# EAGLE design teatimer (EAGLE 8.0.0)
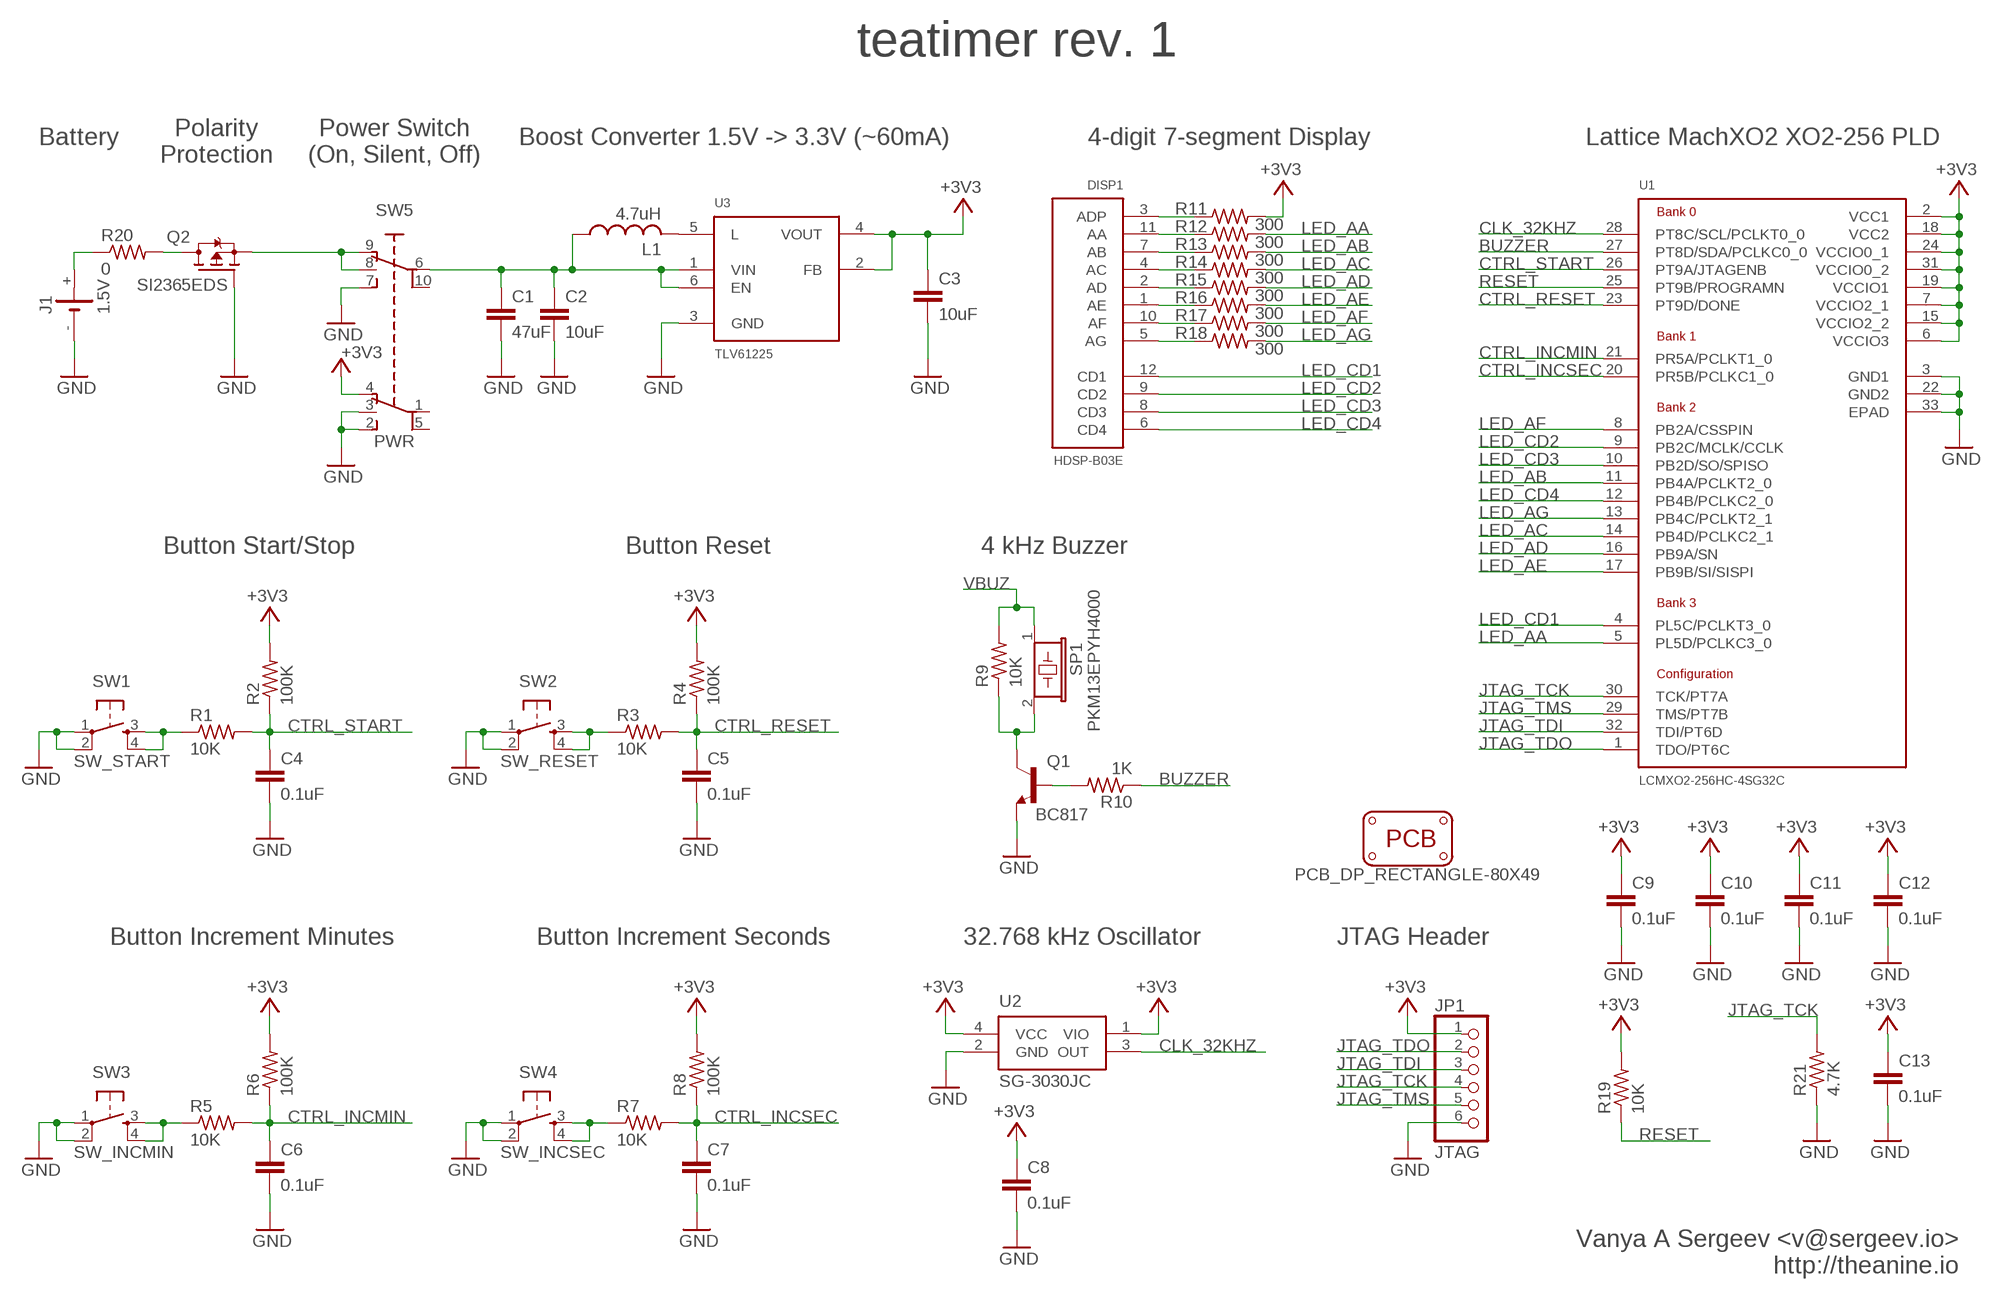
[diagram p0: schematic, sheet 1]

## Parts
C1  47uF  C-EUC0805  [C0805]
C2  10uF  C-EUC0603  [C0603]
C3  10uF  C-EUC0603  [C0603]
C4  0.1uF  C-EUC0603  [C0603]
C5  0.1uF  C-EUC0603  [C0603]
C6  0.1uF  C-EUC0603  [C0603]
C7  0.1uF  C-EUC0603  [C0603]
C8  0.1uF  C-EUC0603  [C0603]
C9  0.1uF  C-EUC0603  [C0603]
C10  0.1uF  C-EUC0603  [C0603]
C11  0.1uF  C-EUC0603  [C0603]
C12  0.1uF  C-EUC0603  [C0603]
C13  0.1uF  C-EUC0603  [C0603]
DISP1  HDSP-B03E  [HDSP-B0XE]
J1  1.5V  BAT-HOLDER-AAA  [AAA-2466]
JP1  JTAG  PINHD-1X6  [1X06/90-SMD]
L1  4.7uH  CIG22L  [L2520]
PCB1  PCB_DP_RECTANGLE-80X49  [DP8049_V1]
Q1  BC817  BC817-40SMD  [SOT23-BEC]
Q2  SI2365EDS  [SOT23]
R1  10K  R-US_R0603  [R0603]
R2  100K  R-US_R0603  [R0603]
R3  10K  R-US_R0603  [R0603]
R4  100K  R-US_R0603  [R0603]
R5  10K  R-US_R0603  [R0603]
R6  100K  R-US_R0603  [R0603]
R7  10K  R-US_R0603  [R0603]
R8  100K  R-US_R0603  [R0603]
R9  10K  R-US_R0603  [R0603]
R10  1K  R-US_R0603  [R0603]
R11  300  R-US_R0603  [R0603]
R12  300  R-US_R0603  [R0603]
R13  300  R-US_R0603  [R0603]
R14  300  R-US_R0603  [R0603]
R15  300  R-US_R0603  [R0603]
R16  300  R-US_R0603  [R0603]
R17  300  R-US_R0603  [R0603]
R18  300  R-US_R0603  [R0603]
R19  10K  R-US_R0603  [R0603]
R20  0  R-US_R0603  [R0603]
R21  4.7K  R-US_R0603  [R0603]
SP1  PKM13EPYH4000  [PKM13EPYH4000]
SW1  SW_START  PTS645  [PTS645]
SW2  SW_RESET  PTS645  [PTS645]
SW3  SW_INCMIN  PTS645  [PTS645]
SW4  SW_INCSEC  PTS645  [PTS645]
SW5  PWR  OS203011MV9QN1  [OS203011MV9QN1]
U1  LCMXO2-256HC-4SG32C  [QFN32G-0.5-5X5MM]
U2  SG-3030JC  [SG-3030JC]
U3  TLV61225  [SC70-6L]

## Nets
+3V3: C3.1 C8.1 C9.1 C10.1 C11.1 C12.1 C13.1 JP1.1 R2.2 R4.2 R6.2 R8.2 R11.2 R19.2 SW5.4(B1) U1.2(VCC1) U1.6(VCCIO3) U1.7(VCCIO2_1) U1.15(VCCIO2_2) U1.18(VCC2) U1.19(VCCIO1) U1.24(VCCIO0_1) U1.31(VCCIO0_2) U2.1(VIO) U2.4(VCC) U3.2(FB) U3.4(VOUT)
BUZZER: R10.1 U1.27(PT8D/SDA/PCLKC0_0)
CLK_32KHZ: U1.28(PT8C/SCL/PCLKT0_0) U2.3(OUT)
CTRL_INCMIN: C6.1 R5.2 R6.1 U1.21(PR5A/PCLKT1_0)
CTRL_INCSEC: C7.1 R7.2 R8.1 U1.20(PR5B/PCLKC1_0)
CTRL_RESET: C5.1 R3.2 R4.1 U1.23(PT9D/DONE)
CTRL_START: C4.1 R1.2 R2.1 U1.26(PT9A/JTAGENB)
GND: C1.2 C2.2 C3.2 C4.2 C5.2 C6.2 C7.2 C8.2 C9.2 C10.2 C11.2 C12.2 C13.2 J1.- JP1.6 Q1.E Q2.1(G) R21.1 SW1.1(P) SW1.2(P1) SW2.1(P) SW2.2(P1) SW3.1(P) SW3.2(P1) SW4.1(P) SW4.2(P1) SW5.2(B3) SW5.3(B2) SW5.7(A3) U1.3(GND1) U1.22(GND2) U1.33(EPAD) U2.2(GND) U3.3(GND)
JTAG_TCK: JP1.4 R21.2 U1.30(TCK/PT7A)
JTAG_TDI: JP1.3 U1.32(TDI/PT6D)
JTAG_TDO: JP1.2 U1.1(TDO/PT6C)
JTAG_TMS: JP1.5 U1.29(TMS/PT7B)
LED_AA: R12.2 U1.5(PL5D/PCLKC3_0)
LED_AB: R13.2 U1.11(PB4A/PCLKT2_0)
LED_AC: R14.2 U1.14(PB4D/PCLKC2_1)
LED_AD: R15.2 U1.16(PB9A/SN)
LED_AE: R16.2 U1.17(PB9B/SI/SISPI)
LED_AF: R17.2 U1.8(PB2A/CSSPIN)
LED_AG: R18.2 U1.13(PB4C/PCLKT2_1)
LED_CD1: DISP1.12(CD1) U1.4(PL5C/PCLKT3_0)
LED_CD2: DISP1.9(CD2) U1.9(PB2C/MCLK/CCLK)
LED_CD3: DISP1.8(CD3) U1.10(PB2D/SO/SPISO)
LED_CD4: DISP1.6(CD4) U1.12(PB4B/PCLKC2_0)
N$1: Q2.2(S) SW5.8(A2) SW5.9(A1)
N$2: L1.2 U3.5(L)
N$3: R3.1 SW2.3(S) SW2.4(S1)
N$4: R1.1 SW1.3(S) SW1.4(S1)
N$5: R5.1 SW3.3(S) SW3.4(S1)
N$6: R7.1 SW4.3(S) SW4.4(S1)
N$7: Q1.C R9.1 SP1.2
N$8: Q1.B R10.2
N$9: DISP1.3(ADP) R11.1
N$10: DISP1.11(AA) R12.1
N$11: DISP1.7(AB) R13.1
N$12: DISP1.4(AC) R14.1
N$13: DISP1.2(AD) R15.1
N$14: DISP1.1(AE) R16.1
N$15: DISP1.10(AF) R17.1
N$16: DISP1.5(AG) R18.1
N$17: J1.+ R20.1
N$18: Q2.3(D) R20.2
RESET: R19.1 U1.25(PT9B/PROGRAMN)
VBAT: C1.1 C2.1 L1.1 SW5.6(P1) U3.1(VIN) U3.6(EN)
VBUZ: R9.2 SP1.1
Unconnected: SW5.1(Q1) SW5.5(Q2) SW5.10(P2)

## Notes on the sheet
- teatimer rev. 1
- Battery | Boost Converter 1.5V -> 3.3V (~60mA) | 4-digit 7-segment Display | Lattice MachXO2 XO2-256 PLD
- Polarity
  Protection
- Power Switch
  (On, Silent, Off)
- Button Start/Stop | Button Reset | 4 kHz Buzzer
- Button Increment Minutes | Button Increment Seconds | 32.768 kHz Oscillator | JTAG Header
- Vanya A Sergeev <v@sergeev.io>
  http://theanine.io

## Library data of the parts
C1-C13 = rcl:C-EU: CAPACITOR, European symbol
DISP1 = ivan2:HDSP-B03E
J1 = ivan2:BAT-HOLDER-AAA
JP1 = ivan2:PINHD-1X6: PIN HEADER
L1 = ivan2:CIG22L
PCB1 = ivan2:PCB_DP_RECTANGLE: Dangerous Prototypes Standard Rectangular PCB sizes
Q1 = transistor-npn:BC817*: NPN Transistor
Q2 = ivan2:SI2365EDS
R1-R21 = rcl:R-US_: RESISTOR, American symbol
SP1 = ivan2:PKM13EPYH4000
SW1-SW4 = ivan2:PTS645
SW5 = ivan2:OS203011MV9QN1
U1 = ivan2:LCMXO2-256HC-4SG32C
U2 = ivan2:SG-3030JC
U3 = ivan2:TLV61225

## Board
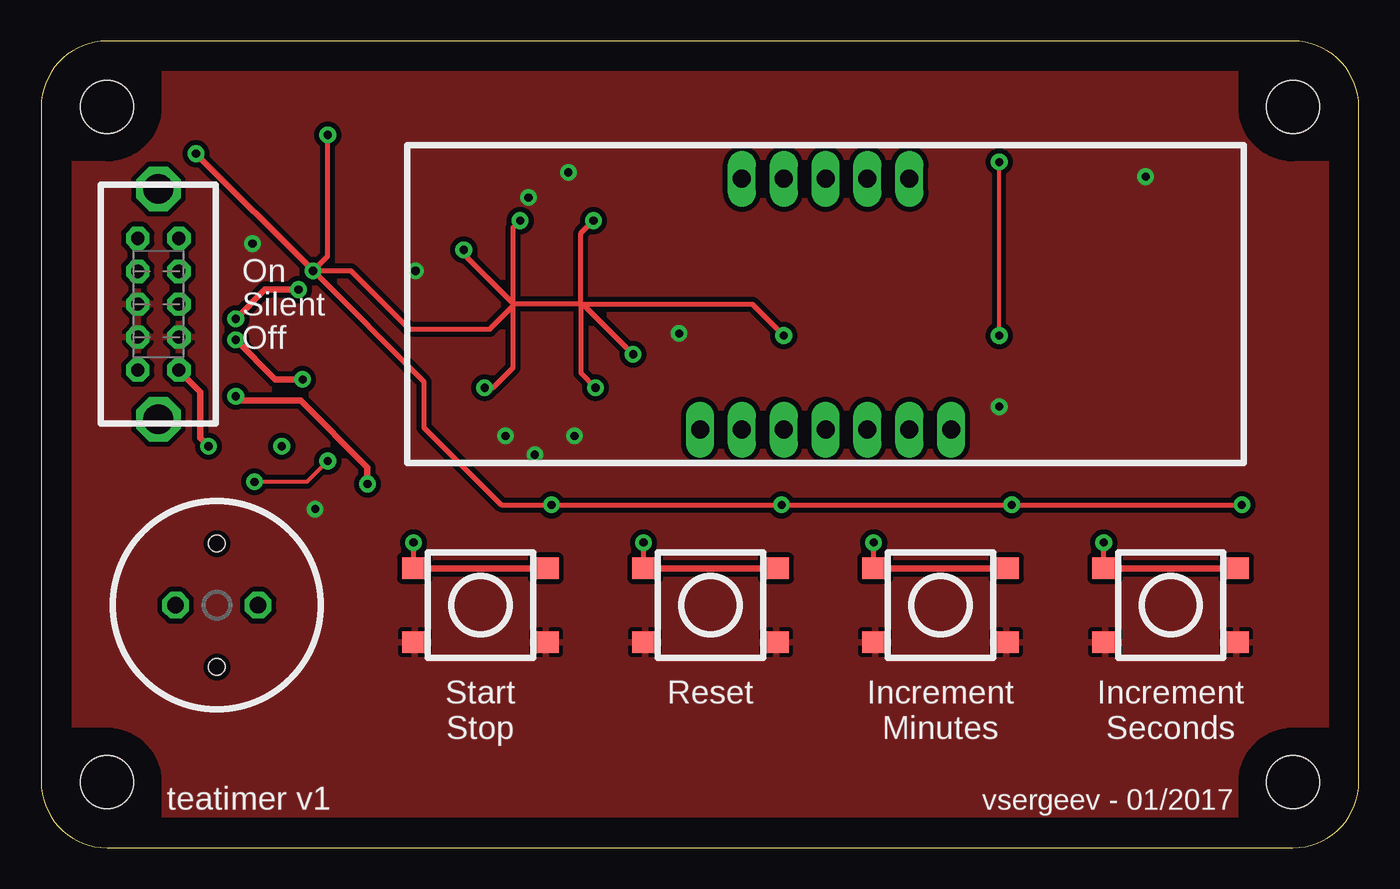
[diagram p1: board, top side]
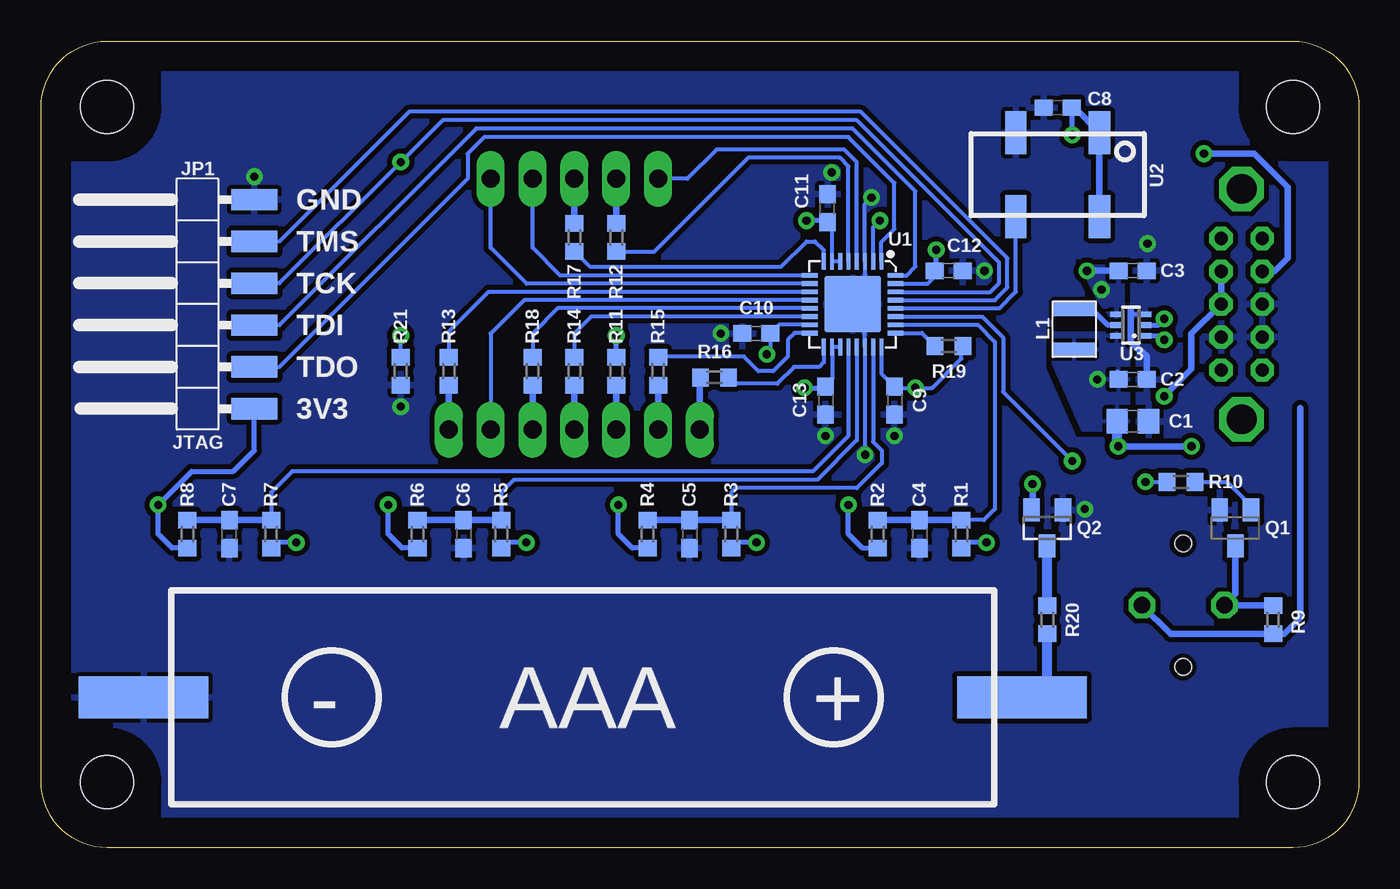
[diagram p2: board, bottom side, seen from below]

Size 80 x 49 mm. Coordinates in mm from the lower left corner, seen from the top.
Copper layers (1*16): Top 0.035mm / dielectric 1.5mm / Bottom 0.035mm
Design rules "SparkFun *": minimum track width 8mil, minimum drill 18mil, track to track 8mil, track to pad 8mil, pad to pad 8mil, via to via 8mil, smd to smd 8mil, copper to edge 10mil, drill to drill 8mil, minimum pad ring 12mil, minimum via ring 10mil, stop-mask expansion 4mil, vias tented up to drill 25mil, thermal gap 10mil

### Footprints (pad centres in the part's own frame; a part is rotated, then mirrored left to right if it is on the bottom)
C0805 = smd 1.3 x 1.5: 1 -0.95,0; 2 0.95,0
C0603 = smd 1.1 x 1: 1 -0.85,0; 2 0.85,0
HDSP-B0XE = drill 1.1 long: 1 -7.62,-7.62; 2 -5.08,-7.62; 3 -2.54,-7.62; 4 0,-7.62; 5 2.54,-7.62; 6 5.08,-7.62; 7 7.62,-7.62; 8 5.08,7.62; 9 2.54,7.62; 10 0,7.62; 11 -2.54,7.62; 12 -5.08,7.62
AAA-2466 = smd 7.874 x 2.54: + 26.67,0; - -26.67,0
1X06/90-SMD = smd 1.3 x 2.8: 1 -6.35,0; 2 -3.81,0; 3 -1.27,0; 4 1.27,0; 5 3.81,0; 6 6.35,0
L2520 = smd 0.85 x 2.5: 1 -1.225,0; 2 1.225,0
DP8049_V1 = hole 3.2: 4,4; 76,4; 76,45; 4,45
SOT23-BEC = smd 1 x 1.4: B -0.95,-1.1; C 0,1.1; E 0.95,-1.1
SOT23 = smd 1 x 1.4: 1 -0.95,-1.1; 2 0.95,-1.1; 3 0,1.1
R0603 = smd 1 x 1.1: 1 -0.85,0; 2 0.85,0
PKM13EPYH4000 = drill 1 octagon: 1 -2.5,0; 2 2.5,0 | hole 1: 0,3.75; 0,-3.75
PTS645 = smd 1.55 x 1.3: 1 -3.975,2.25; 2 3.975,2.25; 3 -3.975,-2.25; 4 3.975,-2.25
OS203011MV9QN1 = drill 0.8 octagon: 1 -4,1.25; 2 -2,1.25; 3 0,1.25; 4 2,1.25; 5 4,1.25; 6 -4,-1.25; 7 -2,-1.25; 8 0,-1.25; 9 2,-1.25; 10 4,-1.25 | drill 1.8 octagon: C1 -7,0; C2 7,0
QFN32G-0.5-5X5MM = smd 1.013 x 0.279: 1 -2.6,1.75; 2 -2.6,1.25; 3 -2.6,0.75; 4 -2.6,0.25; 5 -2.6,-0.25; 6 -2.6,-0.75; 7 -2.6,-1.25; 8 -2.6,-1.75; 17 2.6,-1.75; 18 2.6,-1.25; 19 2.6,-0.75; 20 2.6,-0.25; 21 2.6,0.25; 22 2.6,0.75; 23 2.6,1.25; 24 2.6,1.75 | smd 0.279 x 1.013: 9 -1.75,-2.6; 10 -1.25,-2.6; 11 -0.75,-2.6; 12 -0.25,-2.6; 13 0.25,-2.6; 14 0.75,-2.6; 15 1.25,-2.6; 16 1.75,-2.6; 25 1.75,2.6; 26 1.25,2.6; 27 0.75,2.6; 28 0.25,2.6; 29 -0.25,2.6; 30 -0.75,2.6; 31 -1.25,2.6; 32 -1.75,2.6 | smd 3.429 x 3.429: 33 0,0
SG-3030JC = smd 1.3 x 2.6: 1 -2.54,-2.55; 2 2.54,-2.55; 3 2.54,2.55; 4 -2.54,2.55
SC70-6L = smd 0.35 x 0.8: 1 -0.65,-0.85; 2 0,-0.85; 3 0.65,-0.85; 4 0.65,0.85; 5 0,0.85; 6 -0.65,0.85

### Placement (x,y rotation side)
C1  13.72,25.91 0 bottom
C2  13.72,28.45 0 bottom
C3  13.72,35.05 0 bottom
C4  26.67,19.05 270 bottom
C5  40.64,19.05 270 bottom
C6  54.36,19.05 270 bottom
C7  68.58,19.05 270 bottom
C8  18.29,44.96 180 bottom
C9  28.19,27.18 270 bottom
C10  36.58,31.24 180 bottom
C11  32.26,38.86 90 bottom
C12  24.89,35.05 0 bottom
C13  32.38,27.18 270 bottom
DISP1  47.62,33.02 0 top
J1  47.12,9.14 0 bottom
JP1  67.06,33.02 90 bottom
L1  17.27,31.5 90 bottom
PCB1  0,0 0 top
Q1  7.49,19.43 180 bottom
Q2  18.92,19.43 180 bottom
R1  24.13,19.05 90 bottom
R2  29.21,19.05 270 bottom
R3  38.1,19.05 90 bottom
R4  43.18,19.05 270 bottom
R5  52.07,19.05 90 bottom
R6  57.15,19.05 270 bottom
R7  66.04,19.05 90 bottom
R8  71.12,19.05 270 bottom
R9  5.21,13.84 270 bottom
R10  10.8,22.22 0 bottom
R11  45.09,28.96 90 bottom
R12  45.09,37.08 270 bottom
R13  55.24,28.96 90 bottom
R14  47.62,28.96 90 bottom
R15  42.55,28.96 90 bottom
R16  39.12,28.57 0 bottom
R17  47.62,37.08 270 bottom
R18  50.16,28.96 90 bottom
R19  24.89,30.48 0 bottom
R20  18.92,13.84 90 bottom
R21  58.17,28.96 90 bottom
SP1  10.67,14.73 180 top
SW1  26.67,14.73 180 top
SW2  40.64,14.73 180 top
SW3  54.61,14.73 180 top
SW4  68.58,14.73 180 top
SW5  7.11,33.02 90 top
U1  30.73,33.02 270 bottom
U2  18.29,40.89 180 bottom
U3  13.84,31.75 90 bottom

### Tracks (layer width: path | path; a pad name or v marks a point on that pad's centre or on a via)
+3V3  (via drill 0.5)
  Top 0.254: 32.77,33.02 32.89,33.02
  Top 0.305: 32.77,33.02 28.7,33.02 28.64,33.08 | 28.64,33.08 25.65,36.07 v25.65,36.32 | v72.9,20.83 v58.93,20.83 v44.96,20.83 v30.99,20.83 27.94,20.83 23.24,25.53 23.24,28.32 v16.51,35.05 | 32.77,33.02 43.18,33.02 v45.09,31.11 | 28.64,33.08 28.64,37.66 v29.08,38.1 | 32.77,33.02 32.77,28.83 v33.66,27.94 | 28.64,33.08 28.64,32.89 | 28.64,32.89 28.64,29.15 27.43,27.94 v26.92,27.94 | 32.77,33.02 32.77,37.34 v33.53,38.1 | v16.51,35.05 18.8,35.05 22.35,31.5 27.24,31.5 28.64,32.89 | v16.51,35.05 17.4,35.94 v17.4,43.31 | 32.89,33.02 v35.94,29.97
  Top 0.406: v9.4,42.16 v16.51,35.05 | v11.81,32.13 13.59,33.91 v15.62,33.91
  Bottom 0.254: 31.98,37.99 U1.7 U1.6 | U1.19 U1.18 31.98,28.43 C13.1 | 28.11,34.29 U1.31 26.18,34.27 25.74,34.71 C12.1 | U1.15 35.2,31.77 C10.1 35.73,30.19 v35.94,29.97 | U1.24 28.98,28.82 C9.1 28.11,27.94 v26.92,27.94 25.91,27.94 24.13,29.72 24.13,30.39 R19.2 | U1.2 29.48,37.7 v29.08,38.1
  Bottom 0.305: 32.09,38.1 C11.1 | C12.1 25.65,35.14 v25.65,36.32 | 32.09,38.1 v33.53,38.1 | R11.2 v45.09,31.11 | v30.99,20.83 30.99,19.05 30.14,18.2 R2.2 | R4.2 44.11,18.2 44.96,19.05 v44.96,20.83 | R6.2 58.08,18.2 58.93,19.05 v58.93,20.83 | R8.2 72.05,18.2 72.9,19.05 v72.9,20.83 70.87,22.86 68.33,22.86 67.06,24.13 JP1.1 | 32.09,38.1 31.98,37.99 | v33.66,27.94 32.47,27.94 C13.1 | U3.2 12.19,31.75 v11.81,32.13 | v17.4,43.31 17.4,44.96 C8.1
  Bottom 0.406: U2.4 U2.1 17.26,44.96 C8.1 | C3.1 v16.51,35.05 | SW5.4 5.11,35.02 4.32,35.81 4.32,40.13 6.35,42.16 v9.4,42.16
  pour Bottom: 14.99,32.26 15.75,33.27 16.76,35.31 14.35,35.31 14.35,32.26
BUZZER  (via drill 0.5)
  Top 0.254: v17.4,23.5 16.13,22.22 v12.95,22.22
  Bottom 0.254: U1.27 28.12,32.26 22.86,32.26 21.59,30.99 21.59,27.69 v17.4,23.5 | v12.95,22.22 R10.1
CLK_32KHZ
  Bottom 0.254: U1.28 21.84,32.77 20.83,33.78 U2.3
CTRL_INCMIN
  Bottom 0.254: U1.21 30.48,24.76 32.89,22.35 51.31,22.35 52.07,21.59 R5.2
  Bottom 0.406: R5.2 C6.1 R6.1
CTRL_INCSEC
  Bottom 0.254: U1.20 30.99,25.02 33.15,22.86 64.77,22.86 66.04,21.59 R7.2
  Bottom 0.406: R7.2 C7.1 R8.1
CTRL_RESET
  Bottom 0.254: U1.23 29.48,24.66 28.96,24.13 28.96,23.37 30.48,21.84 37.85,21.84 38.1,21.59 R3.2
  Bottom 0.406: R3.2 C5.1 R4.1
CTRL_START
  Bottom 0.254: U1.26 23.13,31.77 22.1,30.73 22.1,20.57 22.77,19.9 R1.2
  Bottom 0.406: R1.2 C4.1 R2.1
GND  (via drill 0.5)
  Bottom 0.254: 29.98,32 U1.22 29.98,24.01 v29.97,23.88 | 29.98,32 29.98,32.27 U1.33 30.73,33.15 | 29.98,34.43 U1.3 29.98,39.1 v29.59,39.5 | 29.72,32 29.98,32 | U3.3 13.84,32.39
  Bottom 0.406: 13.84,32.77 13.84,32.39 13.84,30.73 12.87,29.88 C2.2
  other vias: 22.73,35.05 32,41.02 38.73,31.24 28.19,25.02 32.38,25.02 67.06,40.77 12.83,36.7 16.64,20.57 58.17,26.8
  pour Bottom (isolate 0.305, rank 3): 2.03,46.99 77.98,46.99 77.98,2.03 2.03,2.03
  pour Top (isolate 0.305, rank 2): 2.03,46.99 77.98,46.99 77.98,2.03 2.03,2.03
  pour Bottom: 13.59,32.77 13.59,33.78 13.34,34.16 13.34,35.43 13.21,35.56 12.19,35.56 11.94,35.31 11.94,33.4 12.95,32.39 13.34,32.39
JTAG_TCK  (via drill 0.5)
  Top 0.254: v58.17,31.11 v58.17,41.66
  Bottom 0.254: U1.30 22.36,33.77 21.84,34.29 21.84,35.56 30.48,44.2 55.63,44.2 v58.17,41.66 65.53,34.29 JP1.4 | R21.2 v58.17,31.11
JTAG_TDI
  Bottom 0.254: U1.32 27.46,34.77 26.92,35.31 26.92,39.88 30.73,43.69 53.59,43.69 65.53,31.75 JP1.3
JTAG_TDO
  Bottom 0.254: U1.1 28.98,36.8 28.19,37.59 28.19,40.39 30.99,43.18 53.09,43.18 54.1,42.16 54.1,40.64 65.53,29.21 JP1.2
JTAG_TMS
  Bottom 0.254: U1.29 22.1,33.27 21.34,34.04 21.34,35.81 30.23,44.7 57.66,44.7 65.53,36.83 JP1.5
LED_AA
  Bottom 0.254: R12.2 45.05,36.2 42.8,36.2 37.08,41.91 31.5,41.91 30.98,41.4 U1.5
LED_AB
  Bottom 0.254: U1.11 52.84,33.77 55.24,31.37 R13.2
LED_AC
  Bottom 0.254: U1.14 46.6,32.27 47.62,31.24 R14.2
LED_AD
  Bottom 0.254: R15.2 42.51,29.84 37.34,29.84 36.45,28.96 35.56,28.96 34.67,29.84 34.67,30.86 34.26,31.27 U1.16
LED_AE
  Bottom 0.254: U1.17 32.48,29.49 32.77,29.21 34.29,29.21 35.31,28.19 37.88,28.19 R16.2 38.14,28.19
LED_AF
  Bottom 0.254: R17.2 46.7,35.31 35.05,35.31 33.53,36.83 33.02,36.83 32.48,36.29 U1.8
LED_AG
  Bottom 0.254: U1.13 48.64,32.77 50.16,31.24 R18.2
LED_CD1
  Bottom 0.254: DISP1.12 40.77,40.64 38.99,42.42 31.24,42.42 30.48,41.66 U1.4
LED_CD2
  Bottom 0.254: U1.9 48.49,34.77 50.16,36.45 DISP1.9
LED_CD3
  Bottom 0.254: U1.10 50.53,34.27 52.71,36.45 DISP1.8
LED_CD4
  Bottom 0.254: U1.12 50.68,33.27 52.71,31.24 DISP1.6
N$1  (via drill 0.5)
  Top 0.406: v11.81,27.43 12.07,27.18 15.75,27.18 19.81,23.11 v19.81,22.1
  Bottom 0.406: Q2.2 19.81,20.59 v19.81,22.1 | SW5.9 SW5.8 10.16,31.22 10.16,29.08 v11.81,27.43
N$2
  Bottom 0.305: L1.2 17.23,32.77 16.26,32.77 15.24,31.75 U3.5
N$3  (via drill 0.5)
  Top 0.305: SW2.4 36.58,17.07 v36.58,18.54
  Top 0.406: SW2.4 SW2.3
  Bottom 0.305: 38.01,18.29 R3.1 37.76,18.54 v36.58,18.54
N$4  (via drill 0.5)
  Top 0.305: SW1.4 22.61,17.07 v22.61,18.54
  Top 0.406: SW1.4 SW1.3
  Bottom 0.305: 24.04,18.29 R1.1 23.79,18.54 v22.61,18.54
N$5  (via drill 0.5)
  Top 0.305: SW3.4 50.55,17.07 v50.55,18.54
  Top 0.406: SW3.4 SW3.3
  Bottom 0.305: 51.98,18.29 R5.1 51.73,18.54 v50.55,18.54
N$6  (via drill 0.5)
  Top 0.305: SW4.4 64.52,17.07 v64.52,18.54
  Top 0.406: SW4.4 SW4.3
  Bottom 0.305: 65.95,18.29 R7.1 65.7,18.54 v64.52,18.54
N$7
  Bottom 0.406: R9.1 5.75,14.73 SP1.2 7.49,15.41 Q1.C
N$8
  Bottom 0.254: R10.2 8,22.22 6.54,20.77 Q1.B
N$9
  Bottom 0.406: R11.1 DISP1.3
N$10
  Bottom 0.406: DISP1.11 R12.1
N$11
  Bottom 0.406: DISP1.7 R13.1
N$12
  Bottom 0.406: DISP1.4 R14.1
N$13
  Bottom 0.406: DISP1.2 R15.1
N$14
  Bottom 0.406: DISP1.1 40.01,28.28 R16.1
N$15
  Bottom 0.406: DISP1.10 R17.1
N$16
  Bottom 0.406: DISP1.5 R18.1
N$17
  Bottom 0.61: J1.+ 18.92,9.14 R20.1
N$18
  Bottom 0.61: R20.2 Q2.3
RESET
  Bottom 0.254: U1.25 26.53,31.27 R19.1
VBAT  (via drill 0.5)
  Top 0.406: v11.81,30.86 14.22,28.45 v15.88,28.45 | SW5.6 8.36,28.98 9.65,27.69 9.65,24.89 v10.16,24.38
  Bottom 0.254: 17.23,30.23 L1.1
  Bottom 0.305: U3.1 12.05,31.1 v11.81,30.86
  Bottom 0.406: 14.67,28.86 C2.1 | v10.16,24.38 v14.61,24.38
  Bottom 0.61: v14.61,24.38 14.67,24.44 C1.1
  pour Bottom: 13.97,25.4 13.97,30.73 14.48,31.24 18.54,31.24 18.54,29.46 16.76,25.4
VBUZ
  Bottom 0.406: SP1.1 11.43,12.99 R9.2 4.53,12.99 3.56,13.97 3.56,26.71

### Text on the board
tNames: On | Silent | Off | Start / Stop | Reset | Increment / Minutes | Increment / Seconds | teatimer v1 | vsergeev - 01/2017
bNames: GND | TMS | TCK | TDI | TDO | 3V3 | JTAG